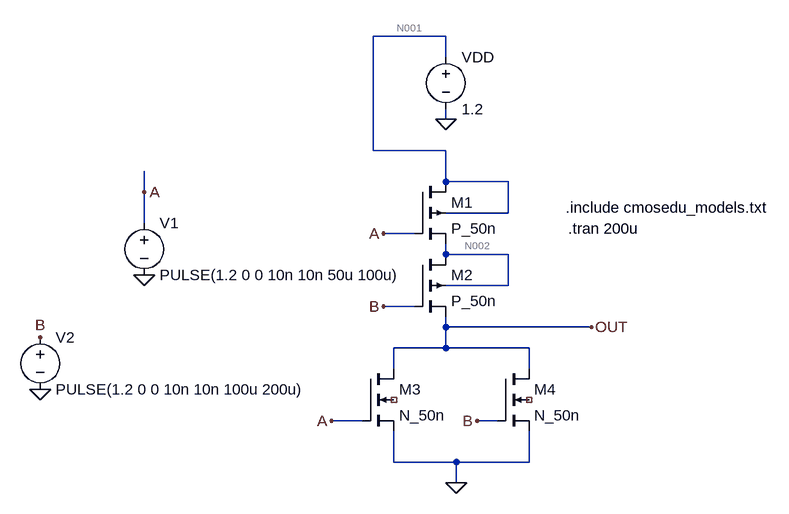
[diagram p0: schematic OR 2 entradas.asc]
OR 2 entradas.asc, the LTspice schematic file:
Version 4
SHEET 1 880 680
WIRE 208 -176 96 -176
WIRE 208 -144 208 -176
WIRE 208 -48 208 -64
WIRE 96 0 96 -176
WIRE 208 0 96 0
WIRE 208 48 208 0
WIRE 304 48 208 48
WIRE -256 64 -256 32
WIRE 304 96 304 48
WIRE 304 96 208 96
WIRE -256 112 -256 64
WIRE 160 128 112 128
WIRE 208 160 208 144
WIRE 304 160 208 160
WIRE 304 208 304 160
WIRE 304 208 208 208
WIRE 160 240 112 240
WIRE 208 272 208 256
WIRE 432 272 208 272
WIRE 208 304 208 272
WIRE 208 304 128 304
WIRE 336 304 208 304
WIRE 128 336 128 304
WIRE 336 336 336 304
WIRE 80 416 32 416
WIRE 288 416 256 416
WIRE 128 480 128 432
WIRE 224 480 128 480
WIRE 336 480 336 432
WIRE 336 480 224 480
WIRE 224 512 224 480
FLAG 208 -48 0
FLAG 112 128 A
FLAG 112 240 B
FLAG 256 416 B
FLAG 32 416 A
FLAG -256 64 A
FLAG 224 512 0
FLAG -256 192 0
FLAG -416 368 0
FLAG -416 288 B
FLAG 432 272 OUT
SYMBOL pmos4 160 48 R0
SYMATTR InstName M1
SYMATTR Value P_50n
SYMATTR Value2 l=50n w=1.12u
SYMBOL pmos4 160 160 R0
SYMATTR InstName M2
SYMATTR Value P_50n
SYMATTR Value2 l=50n w=1.12u
SYMBOL nmos4 80 336 R0
SYMATTR InstName M3
SYMATTR Value N_50n
SYMATTR Value2 l=50n w=0.5u
SYMBOL nmos4 288 336 R0
SYMATTR InstName M4
SYMATTR Value N_50n
SYMATTR Value2 l=50n w=0.5u
SYMBOL voltage 208 -160 R0
WINDOW 123 0 0 Left 2
WINDOW 39 0 0 Left 2
SYMATTR InstName VDD
SYMATTR Value 1.2
SYMBOL voltage -256 96 R0
WINDOW 123 0 0 Left 2
WINDOW 39 0 0 Left 2
SYMATTR InstName V1
SYMATTR Value PULSE(1.2 0 0 10n 10n 50u 100u)
SYMBOL voltage -416 272 R0
WINDOW 123 0 0 Left 2
WINDOW 39 0 0 Left 2
SYMATTR InstName V2
SYMATTR Value PULSE(1.2 0 0 10n 10n 100u 200u)
TEXT 392 88 Left 2 !.include cmosedu_models.txt
TEXT 396 120 Left 2 !.tran 200u

The netlist it stands for:
* OR 2 entradas.asc
M1 N001 A N002 N001 P_50n l=50n w=1.12u
M2 N002 B OUT N002 P_50n l=50n w=1.12u
M3 OUT A 0 NC_01 N_50n l=50n w=0.5u
M4 OUT B 0 NC_02 N_50n l=50n w=0.5u
VDD N001 0 1.2
V1 A 0 PULSE(1.2 0 0 10n 10n 50u 100u)
V2 B 0 PULSE(1.2 0 0 10n 10n 100u 200u)
.model NMOS NMOS
.model PMOS PMOS
.lib standard.mos
.include cmosedu_models.txt
.tran 200u
.backanno
.end

* Results of the author's LTspice run, read from the files saved beside the schematic
* Operating Point, zero values left out:
*   V(n001) = 1.2 V
*   V(a) = 1.2 V
*   V(n002) = 1.131 V
*   V(b) = 1.2 V
*   V(out) = 15.46 µV
*   Id(M4) = 13.94 nA
*   Ig(M4) = 4.532 nA
*   Is(M4) = -18.47 nA
*   Id(M3) = 13.94 nA
*   Ig(M3) = 4.532 nA
*   Is(M3) = -18.47 nA
*   Id(M2) = 1.451 nA
*   Ig(M2) = 26.41 nA
*   Ib(M2) = 6.79 pA
*   Is(M2) = -27.87 nA
*   Id(M1) = 1.443 nA
*   Ig(M1) = 15.05 pA
*   Is(M1) = -1.458 nA
*   I(V2) = -30.95 nA
*   I(V1) = -4.547 nA
*   I(Vdd) = -1.443 nA
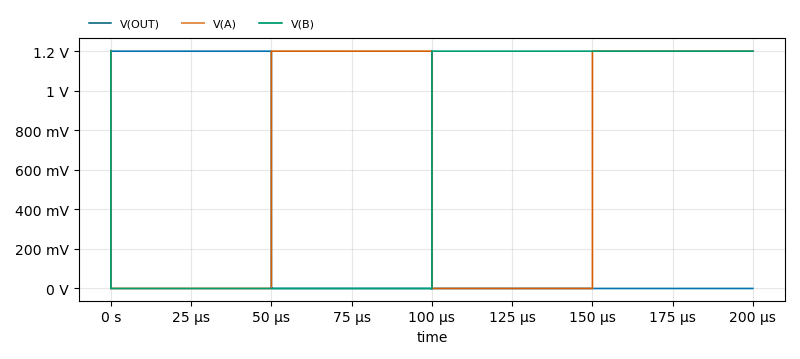
[diagram p1: Transient Analysis of OR 2 entradas.asc, plotted from the saved traces]
* Transient Analysis, 1 run:
*   V(OUT): min -1.655 mV, max 1.204 V, average 300.1 mV, rms 600 mV, last 15.46 µV
*   V(A): min 0 V, max 1.2 V, average 599.9 mV, rms 848.4 mV, last 1.2 V
*   V(B): min 0 V, max 1.2 V, average 599.9 mV, rms 848.5 mV, last 1.2 V